# EAGLE design LTC3105_DoubleCharger (EAGLE 7.2.0)
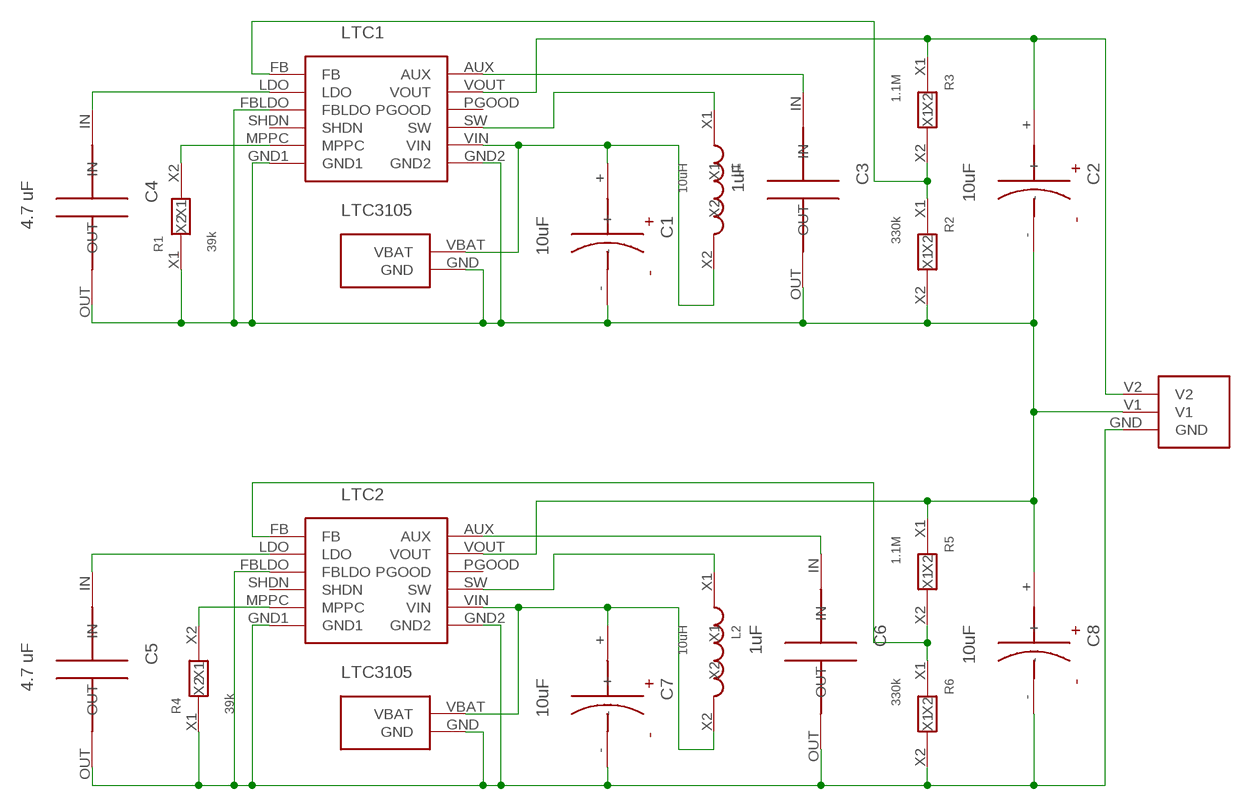
[diagram p0: schematic, sheet 1]

## Parts
C1  10uF  C_ELT_2MM  [C_ELT_2MM]
C2  10uF  C_ELT_2MM  [C_ELT_2MM]
C3  1uF  C_CER_5MM  [C_CER_5MM]
C4  4.7 uF  C_CER_5MM  [C_CER_5MM]
C5  4.7 uF  C_CER_5MM  [C_CER_5MM]
C6  1uF  C_CER_5MM  [C_CER_5MM]
C7  10uF  C_ELT_2MM  [C_ELT_2MM]
C8  10uF  C_ELT_2MM  [C_ELT_2MM]
L1  10uH  L_10X3  [L_10X3]
L2  10uH  L_10X3  [L_10X3]
LTC1  LTC3105  [LTC3105]
LTC2  LTC3105  [LTC3105]
R1  39k  R_6X2  [R_6X2]
R2  330k  R_6X2  [R_6X2]
R3  1.1M  R_6X2  [R_6X2]
R4  39k  R_6X2  [R_6X2]
R5  1.1M  R_6X2  [R_6X2]
R6  330k  R_6X2  [R_6X2]
U$1  BAT3_PLUG  [BAT3_PLUG]
U$3  BAT_PLUG  [BAT_PLUG]
U$10  BAT_PLUG  [BAT_PLUG]

## Nets
LTC1: LTC1.FB R2.X1 R3.X2
N$1: LTC1.MPPC R1.X2
N$2: C4.IN LTC1.LDO
N$4: C3.IN LTC1.AUX
N$5: L1.X1 LTC1.SW
N$6: LTC2.MPPC R4.X2
N$7: C2.+ LTC1.VOUT R3.X1 U$1.V2
N$8: C5.IN LTC2.LDO
N$9: C5.OUT C6.OUT C7.- C8.- LTC2.FBLDO LTC2.GND1 LTC2.GND2 R4.X1 R6.X2 U$1.GND U$3.GND
N$10: C1.+ L1.X2 LTC1.VIN U$10.VBAT
N$11: C7.+ L2.X2 LTC2.VIN U$3.VBAT
N$12: L2.X1 LTC2.SW
N$13: C6.IN LTC2.AUX
N$14: C1.- C2.- C3.OUT C4.OUT C8.+ LTC1.FBLDO LTC1.GND1 LTC1.GND2 LTC2.VOUT R1.X1 R2.X2 R5.X1 U$1.V1 U$10.GND
N$15: LTC2.FB R5.X2 R6.X1
Unconnected: LTC1.PGOOD LTC1.SHDN LTC2.PGOOD LTC2.SHDN

## Library data of the parts
C1 C2 C7 C8 = MyDuino:C_ELT_2MM
C3-C6 = MyDuino:C_CER_5MM
L1 L2 = MyDuino:L_10X3
LTC1 LTC2 = MyDuino:LTC3105
R1-R6 = MyDuino:R_6X2
U$1 = MyDuino:BAT3_PLUG
U$3 U$10 = MyDuino:BAT_PLUG

## Board
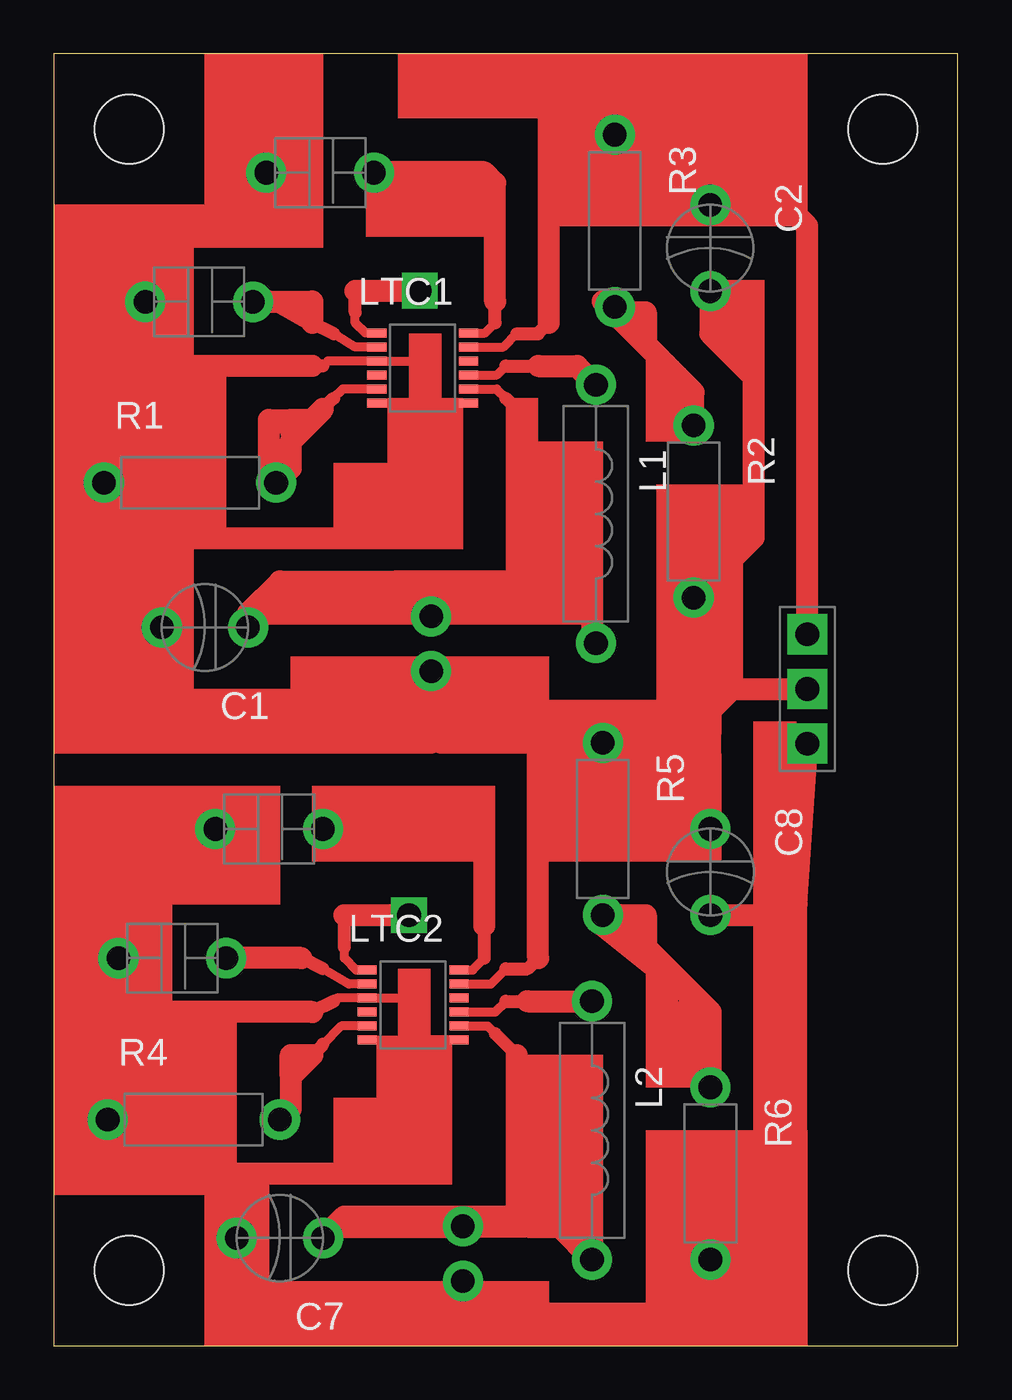
[diagram p1: board, top side]
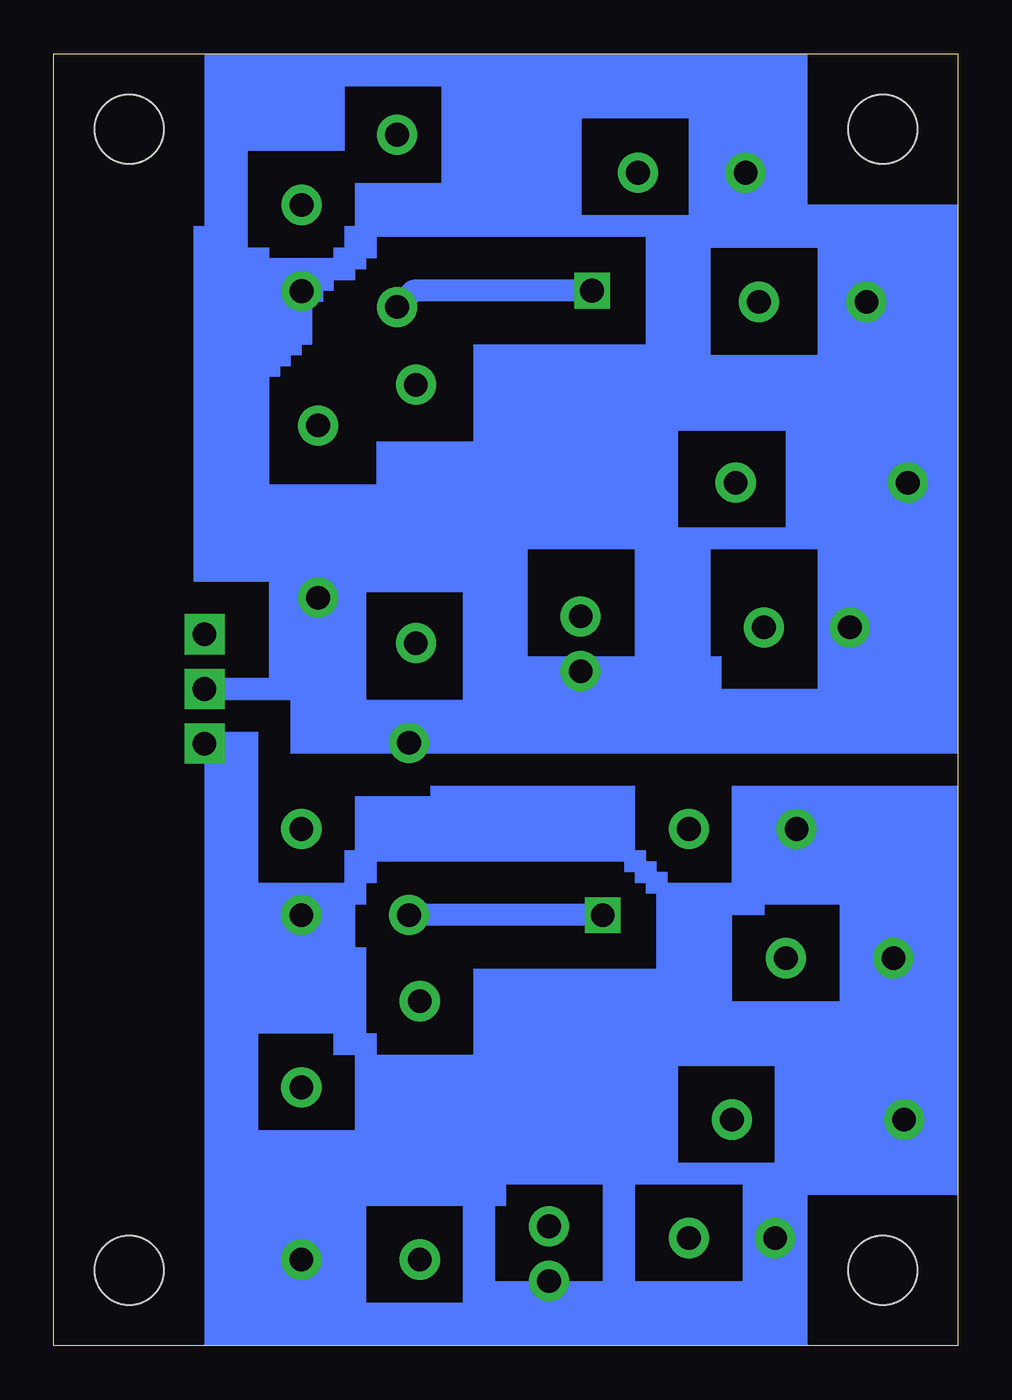
[diagram p2: board, bottom side, seen from below]

Size 42 x 60 mm. Coordinates in mm from the lower left corner, seen from the top.
Outline: 0,0 42,0 42,60 0,60 0,0
Copper layers (1*16): Top 0.035mm / dielectric 1.5mm / Bottom 0.035mm
Design rules "default *": minimum track width 15mil, minimum drill 24mil, track to track 15mil, track to pad 15mil, pad to pad 15mil, via to via 15mil, smd to smd 8mil, copper to edge 40mil, drill to drill 8mil, minimum pad ring 15mil, minimum via ring 8mil, stop-mask expansion 4mil, vias tented up to drill 0mil, thermal gap 10mil
Holes 3.2 mm at 3.5,3.5 3.5,56.5 38.5,56.5 38.5,3.5

### Footprints (pad centres in the part's own frame; a part is rotated, then mirrored left to right if it is on the bottom)
C_ELT_2MM = drill 1.1: + -2,0; - 2,0
C_CER_5MM = drill 1.1: IN -2.5,0; OUT 2.5,0
L_10X3 = drill 1.1: X1 -6,0; X2 6,0
LTC3105 = smd 0.89 x 0.42: AUX 3.82,1.95; FB -0.45,1.95; FBLDO -0.45,0.65; GND1 -0.45,-1.3; GND2 3.82,-1.3; LDO -0.45,1.3; MPPC -0.45,-0.65; PGOOD 3.82,0.65; SHDN -0.45,0; SW 3.82,0; VIN 3.82,-0.65; VOUT 3.82,1.3
R_6X2 = drill 1.1: X1 -4,0; X2 4,0
BAT3_PLUG = drill 1.1 square: GND 0,-2.54; V1 0,0; V2 0,2.54
BAT_PLUG = drill 1.1: GND 0,0; VBAT 0,2.54

### Placement (x,y rotation side)
C1  7.02,33.36 180 top
C2  30.49,50.98 270 top
C3  12.37,54.48 180 top
C4  6.75,48.48 180 top
C5  5.5,18 180 top
C6  10,24 180 top
C7  10.5,5 180 top
C8  30.5,22 270 top
L1  25.18,38.63 270 top
L2  25,10 270 top
LTC1  15.45,45.08 0 top
LTC2  15,15.5 0 top
R1  6.33,40.08 0 top
R2  29.72,38.74 270 top
R3  26.06,52.24 270 top
R4  6.5,10.5 0 top
R5  25.5,24 270 top
R6  30.5,8 270 top
U$1  35,30.5 0 top
U$3  19,3 0 top
U$10  17.53,31.33 0 top

### Tracks (layer width: path | path; a pad name or v marks a point on that pad's centre or on a via)
LTC1  (via drill 1.1)
  Top 0.406: LTC1.FB 14.47,47.03 14,47.5 14,48
  Top 0.61: 14,48 14,49
  Top 1.016: R2.X1 29.72,44.28 27.5,46.5 | 27.5,46.5 26,48 | 26,48 25.5,48.5 25.8,48.5 R3.X2 | 14,49 v17,49 | 26,48 27.5,48 27.5,46.5
  Bottom 1.016: v17,49 25.3,49 R3.X2
N$1
  Top 0.406: LTC1.MPPC 13.43,44.43 13,44
  Top 0.61: 13,44 12.5,43.5
  Top 1.016: 10,40.5 10,43 11,43 | 12.5,43.5 12,43 | 12,43 11,42 11,40.75 R1.X2 | 12,43 11,43 | 11,43 11,42.5
N$2
  Top 0.406: LTC1.LDO 14,46.38 13,47
  Top 0.61: 13,47 12,47.5
  Top 0.813: 12,47.5 10.23,48.5 C4.IN
N$4
  Top 0.406: LTC1.AUX 20.03,47.03 20.5,47.5
  Top 0.61: 20.5,47.5 20.5,48.5
  Top 1.016: 20.5,48.5 20.5,54 20,54.5 14.89,54.5 C3.IN
N$5
  Top 0.406: LTC1.SW 20.58,45.08 21,45.5
  Top 0.61: 21,45.5 22.5,45.5
  Top 1.016: 22.5,45.5 24.31,45.5 L1.X1
N$6
  Top 0.406: LTC2.MPPC 13.35,14.85 12.5,14
  Top 0.61: 12.5,14 12,13.5
  Top 1.016: 11,12.5 12,13.5 11,13.5 11,12.5 | 11,12.5 11,11 R4.X2
N$7
  Top 0.406: LTC1.VOUT 20.88,46.38 21.5,47
  Top 0.61: 21.5,47 22.5,47 23,47.5
  Top 1.016: U$1.V2 35,52 34,53 30.51,53 C2.+ 26.73,56.24 R3.X1 23,54.18 23,47.5
N$8
  Top 0.406: LTC2.LDO 13.7,16.8 12.5,17.5
  Top 0.61: 12.5,17.5 11.5,18
  Top 1.016: 11.5,18 C5.IN
N$9
  Top 0.406: 13,16 13.15,16.15 LTC2.FBLDO 16.35,16.15 16.5,16 16.5,14 | LTC2.GND2 16.7,14.2 16.5,14 | LTC2.GND1 16.3,14.2 16.5,14
  Top 0.61: 13,16 12,15.5
  Top 1.016: 2.5,15.5 R4.X1 2.5,7.5 8.5,7.5 C7.- 8.5,2.5 9.5,1.5 19,1.5 | 2.5,15.5 2.5,17.5 C5.OUT 3,22 5,24 C6.OUT | C8.- 34,20 34.5,20.5 | 34.5,20.5 U$1.GND | 19,1.5 30.5,1.5 | 30.5,1.5 32.5,1.5 34.5,4 34.5,20.5 | R6.X2 30.5,1.5 | U$3.GND 19,1.5 | 12,15.5 2.5,15.5
N$10
  Top 0.406: LTC1.VIN 20.57,44.43 21,44
  Top 0.61: 21,44 21.5,43.5
  Top 1.016: C1.+ 9.02,34.02 10.5,35.5 15.9,35.5 U$10.VBAT 17.87,33.87 19,35 21.5,35 | 21.5,35 24.5,35 25,34.5 25,32.81 L1.X2 | 21.5,43.5 21.5,35
N$11
  Top 0.406: LTC2.VIN 20.15,14.85 20.5,14.5
  Top 0.61: 20.5,14.5 21.5,13.5
  Top 1.016: C7.+ 13.5,6 18.54,6 U$3.VBAT 21.5,5.54 | 21.5,5.54 23.46,5.54 L2.X2 | 21.5,13.5 21.5,5.54
N$12
  Top 0.406: LTC2.SW 20.5,15.5 21,16
  Top 0.61: 21,16 22,16
  Top 1.016: 22,16 L2.X1
N$13
  Top 0.406: LTC2.AUX 19.45,17.45 20,18
  Top 0.61: 20,18 20,19.5
  Top 1.016: 20,19.5 20,23 19,24 C6.IN
N$14
  Top 0.406: 12.5,45.5 12.73,45.73 LTC1.FBLDO 16.77,45.73 17,45.5 17,44 | 17,44 17,43.5 16.72,43.78 LTC1.GND1 | LTC1.GND2 17.22,43.78 17,44 | LTC2.VOUT 20.3,16.8 21,17.5
  Top 0.61: 12.5,45.5 12,45.5 | 21,17.5 22,17.5 22.5,18
  Top 1.016: 2.33,45.5 R1.X1 2.5,39.91 2.5,34.5 3.64,33.36 C1.- 5,33.34 5,29 6,28 17.5,28 17.53,28.03 U$10.GND 17.5,31.3 17.5,28.5 18,28 23,28 | 2.33,45.5 2.33,46.56 C4.OUT 4.25,51.75 5,52.5 8.39,52.5 C3.OUT | 31.5,30.5 30.72,31.28 R2.X2 32.5,37.52 32.5,45 30.49,47.01 C2.- | 31.5,30.5 U$1.V1 | C8.+ 30.5,28.5 | 30.5,28.5 30.5,29.5 31.5,30.5 | 30.5,28.5 30,28 R5.X1 23,28 | 12,45.5 2.33,45.5 | 22.5,18 22.5,27.5 23,28
N$15  (via drill 1.1)
  Top 0.406: LTC2.FB 14.05,17.45 13.5,18 13.5,18.5
  Top 0.61: 13.5,18.5 13.5,20
  Top 1.016: 27.5,18.5 26,20 R5.X2 27.5,20 27.5,18.5 | 27.5,18.5 30.5,15.5 | 30.5,15.5 R6.X1 | 13.5,20 v16.5,20 | 25.5,19.5 30.5,15.5
  Bottom 1.016: v16.5,20 R5.X2
N$16
  Top 1.016: 10,48.5 12,48.5 12,47.5
(copper drawn outside any net)
  shapes: Bottom area x81, Top area x60